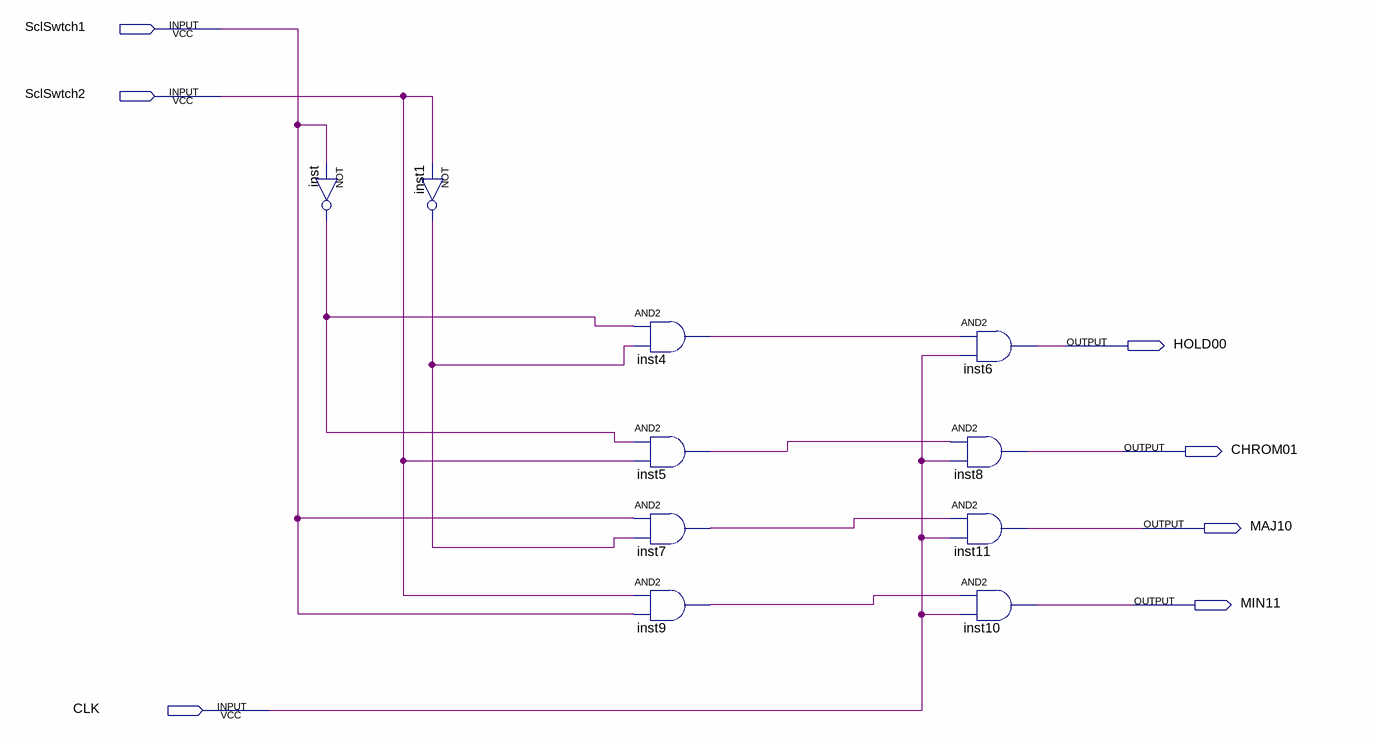
[diagram p0: schematic sheet]
// Quartus schematic Decoder.bdf as structural Verilog: 10 symbols, 7 pins
module Decoder (
  input  SclSwtch1,
  input  SclSwtch2,
  input  CLK,
  output HOLD00,
  output CHROM01,
  output MAJ10,
  output MIN11
);

  wire inst1_out, inst4_out, inst5_out, inst7_out, inst9_out, inst_out;

  not inst (inst_out, SclSwtch1);
  not inst1 (inst1_out, SclSwtch2);
  and inst4 (inst4_out, inst_out, inst1_out);
  and inst5 (inst5_out, inst_out, SclSwtch2);
  and inst7 (inst7_out, SclSwtch1, inst1_out);
  and inst9 (inst9_out, SclSwtch2, SclSwtch1);
  and inst6 (HOLD00, inst4_out, CLK);
  and inst8 (CHROM01, inst5_out, CLK);
  and inst11 (MAJ10, inst7_out, CLK);
  and inst10 (MIN11, inst9_out, CLK);
endmodule
